# EasyEDA Pro project ProProject_训练营23_2023-12-06.epro, board PCB_PCB_不带频谱时钟_2_2023-11-23
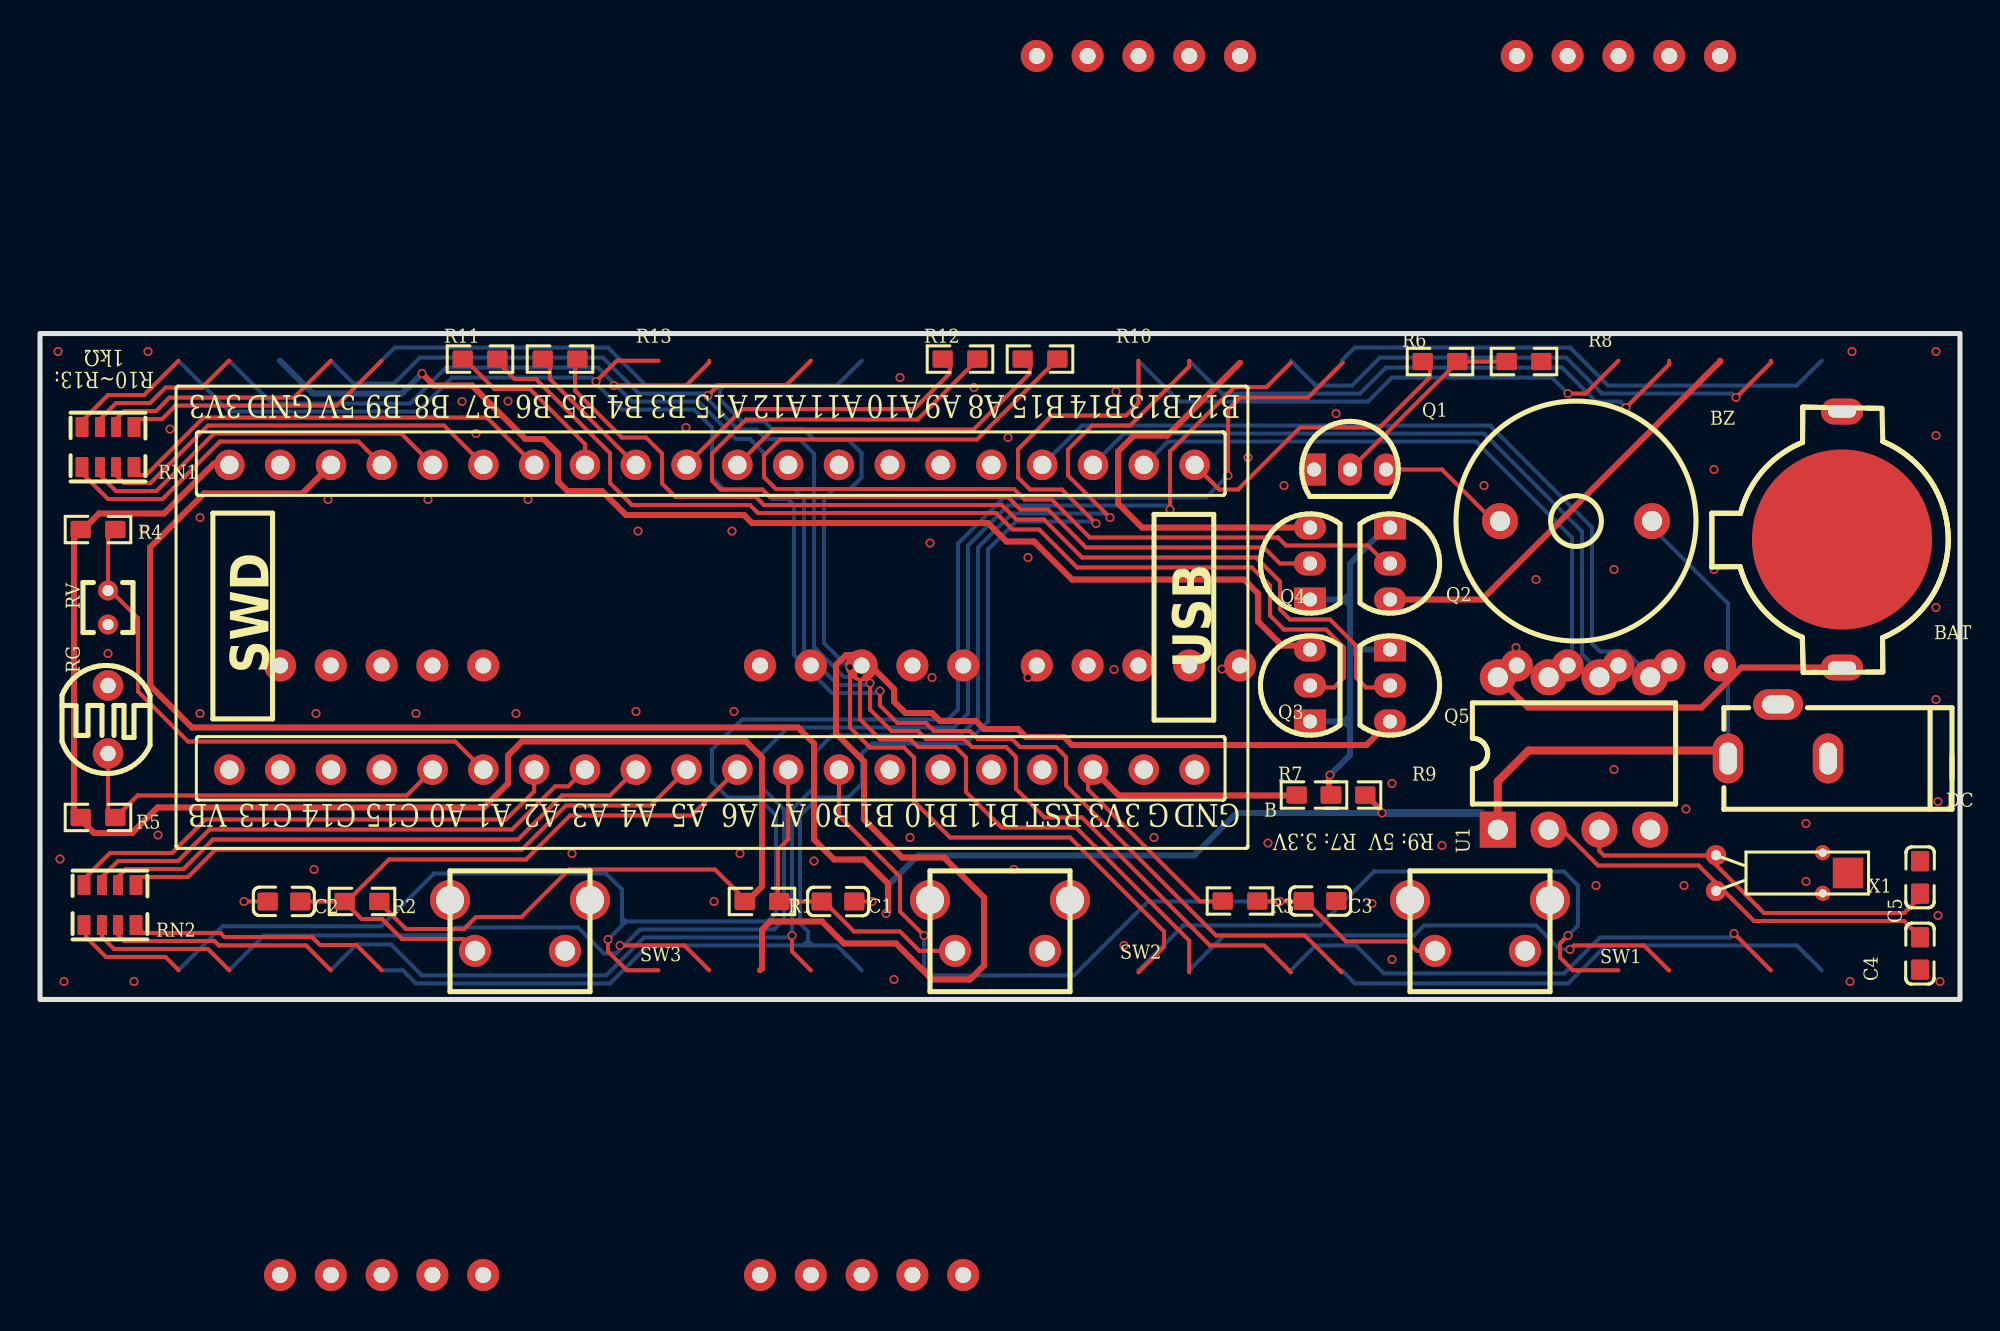
[diagram p5: board, top side]
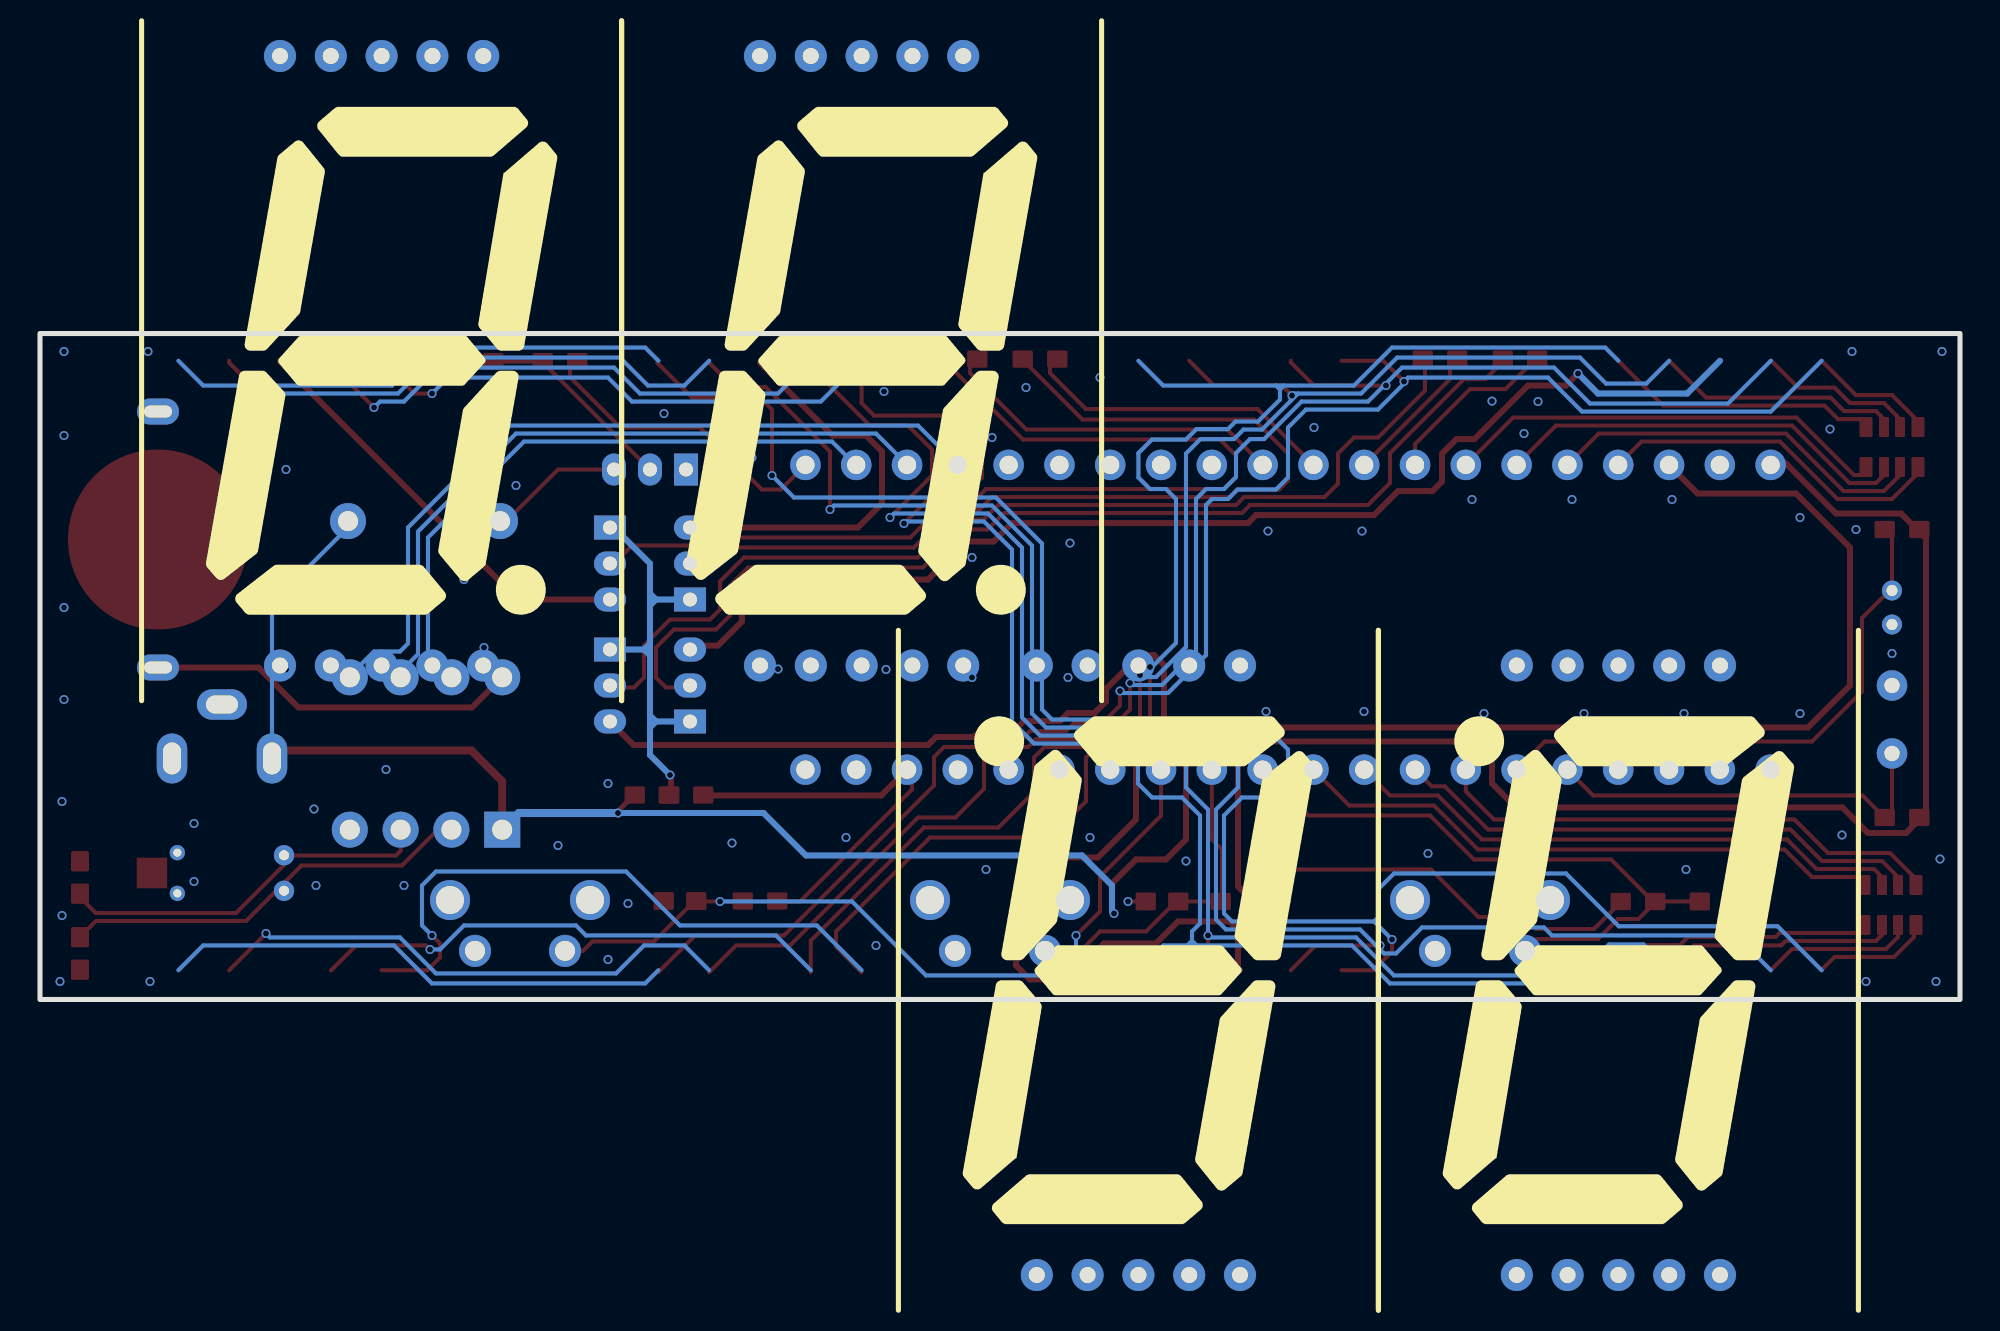
[diagram p6: board, bottom side, seen from below]

Outline 96 x 33.3 mm; copper layers: Top Layer, Bottom Layer. Coordinates in mm from the lower left corner of the outline.
Outline path: rectangle 0,33.3 96,0
Stack: Top Layer 0.035mm / Dielectric1 1.51mm FR4 er 4.5 / Bottom Layer 0.035mm

## Design rules (mm)
template: 用户自定义配置
spacing Default (default): track to track 0.152, other pairs 0 to 0.152
track width Default (default): min 0.152, default 0.203, max 25.4
differential pair differentialPair (default): width min 0.127, default 0.254, max 2.54; gap min 0.152, default 0.152
via Default (default): diameter min 0.45, default 0.45, max 100.025; hole min 0.3, default 0.3, max 59.995

## Placement (name value [footprint] x y rotation side)
B  -  [STM32F103C8T6核心板]  33.46 19.11 90 top
BAT  MY-1220-01  [BAT-TH_MY-1220-01]  90.1 23 270 top
BZ  2.3kHz  [BUZ-TH_BD12.0-P7.60-D0.6-FD]  76.8 23.92 180 top
C1  100nF  [C0603]  39.9 4.9 180 top
C2  100nF  [C0603]  12.2 4.9 0 top
C3  100nF  [C0603]  64 4.92 180 top
C4  22pF  [C0603]  94 2.3 90 top
C5  22pF  [C0603]  94 6.1 270 top
DC  DC-002-2.0A-1.65  [dc-in_dc-002-2.0a-1.65]  86.9 13.4 180 top
LED1  -  [1寸数码管]  84 16.7 180 bottom
LED2  -  [1寸数码管]  60 16.7 180 bottom
LED3  -  [1寸数码管]  36 16.7 0 bottom
LED4  -  [1寸数码管]  12 16.7 0 bottom
Q1  S8050  [s8050_to_92]  65.5 26.5 0 top
Q2  S9012  [S8550P_TO-92]  67.5 21.8 270 top
Q3  S9012  [s8550p_to-92]  63.5 15.7 90 top
Q4  S9012  [s8550p_to-92]  63.5 21.8 90 top
Q5  S9012  [s8550p_to-92]  67.5 15.7 270 top
R1  10K  [R0603]  36.1 4.9 180 top
R2  10K  [R0603]  16.1 4.9 0 top
R3  10K  [R0603]  60 4.92 180 top
R4  10k  [R0603]  2.9 23.5 180 top
R5  10k  [R0603]  2.9 9.1 180 top
R6  1k  [R0603]  70 31.9 0 top
R7  10K  [R0603]  63.7 10.22 180 top
R8  10K  [R0603]  74.2 31.9 180 top
R9  10K  [R0603]  65.4 10.22 0 top
R10  1K  [R0603]  50 32.02 180 top
R11  1K  [R0603]  22 32.02 180 top
R12  1K  [R0603]  46 32.02 180 top
R13  1K  [R0603]  26 32.02 180 top
RG  光敏电阻  [RES-TH_L5.1-W4.3-P3.40-D0.5]  3.4 14 180 top
RN1  470Ω  [RES-ARRAY-SMD_0603-8P-L3.2-W1.6-BL]  3.4 27.62 0 top
RN2  470Ω  [RES-ARRAY-SMD_0603-8P-L3.2-W1.6-BL]  3.5 4.72 0 top
RV  MF52A103F3950 (A1)  [RES-TH_L2.5-W2.5-P1.70-D0.3]  3.4 19.6 90 top
SW1  SKHHLQA010  [KEY-TH_4P-SKHHLQA010]  72 3.7 0 top
SW2  SKHHLQA010  [KEY-TH_4P-SKHHLQA010]  48 3.7 0 top
SW3  SKHHLQA010  [KEY-TH_4P-SKHHLQA010]  24 3.7 0 top
U1  DS1302N  [dip-8_l9.7-w6.4-p2.54-ls7.6-bl]  76.7 12.3 0 top
X1  32.768kHz  [CRYSTAL-TH_BD2.1-P0.70-D0.3]  83.8 6.32 180 top

## Footprints (pads in the part's own frame, mm; a bottom-side part is the same pattern mirrored in y, then rotated)
1寸数码管
  round 1.6 hole 0.8: 1(0,0) 2(2.54,0) 3(5.08,0) 4(7.62,0) 5(10.16,0) 6(10.16,30.48) 7(7.62,30.48) 8(5.08,30.48) 9(2.54,30.48) 10(0,30.48)
BAT-TH_MY-1220-01
  oval 1.3x2.1 hole 0.6x1.4: 1(-6.4,0) 1(6.4,0)
  round 9 smd: 2(0,0)
BUZ-TH_BD12.0-P7.60-D0.6-FD
  round 1.8 hole 1: 1(-3.8,0) 2(3.8,0)
C0603
  rrect 1.016x0.9 smd: 1(-0.813,0) 2(0.813,0)
CRYSTAL-TH_BD2.1-P0.70-D0.3
  oval 1.016x1.016 hole 0.5: 1(0,0.889) 2(0,-0.889)
  rect 1.524x1.524 smd: 3(-6.604,0)
  round 0.762 hole 0.406: 3(-5.334,1.016) 3(-5.334,-1.016)
dc-in_dc-002-2.0a-1.65
  oval 1.524x2.5 hole 0.9x1.6: 1(2.5,1.35) 2(-2.5,1.35)
  oval 2.5x1.524 hole 1.6x0.9: 3(0,-1.35)
dip-8_l9.7-w6.4-p2.54-ls7.6-bl
  rect 1.8x1.8 hole 1: 1(-3.81,-3.81)
  round 1.8 hole 1: 2(-1.27,-3.81) 3(1.27,-3.81) 4(3.81,-3.81) 5(3.81,3.81) 6(1.27,3.81) 7(-1.27,3.81) 8(-3.81,3.81)
KEY-TH_4P-SKHHLQA010
  round 1.6 hole 1: 1(-2.25,-1.27) 2(2.25,-1.27)
  round 2 hole 1.4: 3(3.5,1.27) 4(-3.5,1.27)
R0603
  rrect 1.016x0.864 smd: 1(-0.864,0) 2(0.864,0)
RES-ARRAY-SMD_0603-8P-L3.2-W1.6-BL
  rrect 0.65x1 smd: 1(-1.3,-1) 4(1.3,-1) 5(1.3,1) 8(-1.3,1)
  rrect 0.5x1 smd: 2(-0.4,-1) 3(0.4,-1) 6(0.4,1) 7(-0.4,1)
RES-TH_L2.5-W2.5-P1.70-D0.3
  round 1 hole 0.55: 1(-0.85,0) 2(0.85,0)
RES-TH_L5.1-W4.3-P3.40-D0.5
  round 1.524 hole 0.762x0.767: 1(0,-1.7) 2(0,1.7)
s8050_to_92
  rect 1.2x1.6 hole 0.701: 1(-1.8,0)
  oval 1.2x1.6 hole 0.701: 2(0,0) 3(1.8,0)
s8550p_to-92
  rect 1.2x1.6 hole 0.7: 1(-1.8,0)
  oval 1.2x1.6 hole 0.7: 2(0,0) 3(1.8,0)
S8550P_TO-92
  rect 1.2x1.6 hole 0.7: 1(-1.8,0)
  oval 1.2x1.6 hole 0.7: 2(0,0) 3(1.8,0)
STM32F103C8T6核心板
  round 1.524 hole 0.914: 1(-7.62,23.993) 2(-7.62,21.453) 3(-7.62,18.913) 4(-7.62,16.373) 5(-7.62,13.833) 6(-7.62,11.293) 7(-7.62,8.753) 8(-7.62,6.213) 9(-7.62,3.673) 10(-7.62,1.133) 11(-7.62,-1.407) 12(-7.62,-3.947) 13(-7.62,-6.487) 14(-7.62,-9.027) 15(-7.62,-11.567) 16(-7.62,-14.107) 17(-7.62,-16.647) 18(-7.62,-19.187) 19(-7.62,-21.727) 20(-7.62,-24.267) 21(7.62,-24.267) 22(7.62,-21.727) 23(7.62,-19.187) 24(7.62,-16.647) 25(7.62,-14.107) 26(7.62,-11.567) 27(7.62,-9.027) 28(7.62,-6.487) 29(7.62,-3.947) 30(7.62,-1.407) 31(7.62,1.133) 32(7.62,3.673) 33(7.62,6.213) 34(7.62,8.753) 35(7.62,11.293) 36(7.62,13.833) 37(7.62,16.373) 38(7.62,18.913) 39(7.62,21.453) 40(7.62,23.993)

## Nets
As in the schematic, except:
3V3: B.18 B.40 R1.2 R2.2 R3.2 R4.2 R5.2 R7.2
GND: B.19 B.20 B.39 BAT.2 C1.1 C2.1 C3.1 C4.1 C5.1 DC.2 DC.3 Q1.1 R8.1 RG.1 RV.1 SW1.2 SW1.3 SW1.4 SW2.2 SW2.3 SW2.4 SW3.2 SW3.3 SW3.4 U1.4 X1.3
VCC: B.38 BZ.1 DC.1 R9.2 U1.1
LEDCOM1: LED1.8 Q2.3
LEDCOM2: LED2.8 Q4.3
LEDCOM3: LED3.8 Q5.3
LEDCOM4: LED4.3 Q3.3

Pads without a net: B 1 2 3 4 14 15 16 17 25 26 27 28 29; LED1 3; LED2 3; LED3 3; LED4 8

## Via types
v1: diameter 0.45, hole 0.3, Top Layer to Bottom Layer, 103 vias

## Routing (per net, layer and track width the routed paths; a pad name or vN(x,y) marks a point on that pad's centre or on a via; arc(x,y) is an arc through that point)
3V3: length 110.7
  Top Layer w0.203: 59.35,4.9 58,4.9 52.4,10.5 52.4,11.24 B.18 ; 35.35,4.9 33.75,6.5 26.45,6.5 24.08,4.12 21.8,4.12 21.2,3.52 18.3,3.52 16.92,4.9 16.85,4.9
  Top Layer w0.3: 2.1,9.1 2.1,8.92 2.7,8.32 4.6,8.32 5.88,9.6 22.2,9.6 23.4,10.8 23.4,12.2 24.1,12.9 35.3,12.9 36.1,12.1 36.1,5.65 35.35,4.9 ; 2.1,9.1 2.15,9.1 ; 2.1,9.1 1.7,9.5 1.7,23.05 2.95,24.3 6.2,24.3 8.7,26.8 9.4,26.8 B.40 ; 62.95,10.2 53.94,10.2 B.18
3V32: length 22.4
  Top Layer w0.3: v1(64.5,11.22) 64.45,11.17 64.45,10.79 64.45,10.78 64.45,10.2
  Bottom Layer w0.3: Q2.1 67.3,23.6 65.5,21.8 65.5,20.3 ; 65.8,17.5 65.5,17.2 ; 65.8,17.5 65.5,17.8 ; 65.8,17.5 Q5.1 ; 65.5,17.2 65.5,14.2 ; 65.5,17.2 65.5,17.8 ; 65.5,13.6 65.5,14.2 ; 65.5,13.6 65.2,13.9 ; 65.5,13.6 65.5,12.22 v1(64.5,11.22) ; 65.5,14.2 65.2,13.9 ; 65.2,20 65.5,20.3 ; 65.2,20 Q4.1 ; 65.2,20 65.5,19.7 ; 65.5,20.3 65.5,19.7 ; 65.5,17.8 65.5,19.7 ; 65.2,13.9 Q3.1
GND: length 2.3
  Top Layer w0.203: 40.6,4.9 v1(41.6,4.9) ; 11.5,4.9 v1(10.2,4.9)
  vias: v1(0.9,32.4) v1(1,7.02) v1(1.2,0.9) v1(3.4,17.3) v1(4.7,0.9) v1(5.2,23.5) v1(5.4,32.4) v1(5.9,8.22) v1(6.5,28.52) v1(8,24.1) v1(8,14.3) v1(13.7,6.5) v1(13.8,14.3) v1(14.4,25) v1(18.8,14.3) v1(19.4,25) v1(21.1,29.9) v1(21.8,28.3) v1(23.4,29.92) v1(23.8,14.3) v1(24.4,25) v1(26.6,7.3) v1(29.8,14.4) v1(29.9,23.42) v1(32.3,28.6) v1(33.7,4.9) v1(34.6,23.42) v1(34.7,14.4) v1(35,7.3) v1(38.7,6.92) v1(42.7,1) v1(43,31.1) v1(43.5,8.1) v1(44.5,22.82) v1(44.6,16.1) v1(46.7,30.6) v1(48.4,28.1) v1(48.7,6.5) v1(49.4,22.1) v1(49.4,16.1) v1(53.7,16.5) v1(53.8,30.4) v1(54.2,2.7) v1(55.7,8.1) v1(59.1,16.52) v1(60.4,27.1) v1(61.4,7.82) v1(62.2,25.7) v1(64.8,29.3) v1(66.6,4.8) v1(67.6,10.8) v1(67.6,2) v1(70.1,7.7) v1(72.2,25.7) v1(73.8,17.6) v1(74.8,21) v1(77.8,5.7) v1(78.7,21.5) v1(78.7,11.5) v1(82.2,5.7) v1(82.3,9.52) v1(83.7,26.5) v1(83.7,21.5) v1(83.7,16.5) v1(88.3,8.8) v1(88.3,5.9) v1(90.5,0.9) v1(90.6,32.4) v1(94.8,32.4) v1(94.8,28.2) v1(94.8,19.6) v1(94.8,15) v1(94.9,9.9) v1(94.9,4.2) v1(95,0.9)
VCC: length 125.9
  Top Layer w0.25: R9.2 66.3,10.22 67.1,9.42 v1(67.1,9.32)
  Top Layer w0.3: B.38 13.12,25.3 8.2,25.3 5.5,22.6 5.5,15.7 7.6,13.6 37.9,13.6 38.7,12.8 38.7,8 39.7,7 41.2,7 42.4,5.8 42.4,4.4 v1(42.3,4.3)
  Top Layer w0.4: U1.1 72.89,10.91 74.43,12.45 84,12.45 DC.1
  Bottom Layer w0.203: 80.6,23.6 84.4,19.8 DC.1
  Bottom Layer w0.3: v1(42.3,4.3) 42.4,4.4 42.4,5.7 43.9,7.2 57.7,7.2 59.82,9.32 v1(67.1,9.32)
  Bottom Layer w0.4: U1.1 72.06,9.32 v1(67.1,9.32)
A: length 113
  Top Layer w0.203: 3.9,3.82 3.9,3.22 4.2,2.92 8.72,2.92 8.94,2.7 13.3,2.7 14.54,1.46 ; v1(37.6,3.2) 37.6,2.4 38.54,1.46 ; 81.46,31.94 81.46,31.76 v1(79.3,29.6) ; 57.46,31.94 57.46,31.65 54.51,28.7 52.6,28.7 51.4,27.5 51.4,26.2 v1(53.5,24.1)
  Bottom Layer w0.203: 14.54,1.46 15.83,2.75 17.55,2.75 19.1,1.2 28.3,1.2 30.2,3.1 37.5,3.1 v1(37.6,3.2) 37.6,9.5 38.7,10.6 38.7,12.3 39.6,13.2 46,13.2 46.9,14.1 46.9,22.6 48.6,24.3 53.3,24.3 v1(53.5,24.1) ; v1(79.3,29.6) 79,29.9 77.8,29.9 76.1,31.6 67.3,31.6 66,30.3 59.1,30.3 57.46,31.94
B: length 114.6
  Top Layer w0.203: 78.92,31.94 77.28,30.3 v1(76.4,30.3) ; 4.7,3.82 RN2.4 4.8,3.68 5.16,3.33 9.02,3.33 9.22,3.12 13.6,3.12 14,2.72 15.82,2.72 17.08,1.46 ; v1(52.8,23.8) 51.1,25.5 49.5,25.5 48.9,26.1 48.9,27.51 50.59,29.2 54.3,29.2 54.92,29.82 54.92,31.94
  Bottom Layer w0.203: 54.92,31.94 56.96,29.9 66.4,29.9 67.6,31.1 75.6,31.1 v1(76.4,30.3) ; 38.17,2.7 30.4,2.7 28.5,0.8 18.8,0.8 18.14,1.46 17.08,1.46 ; 38.17,2.7 38.63,2.7 ; 38.17,2.7 38.4,2.93 ; 38.4,2.93 38.63,2.7 ; 38.4,2.93 38.4,3.4 38,3.8 38,9.2 38.9,10.1 40.4,10.1 41.1,10.8 41.1,12.3 41.6,12.8 46.3,12.8 47.4,13.9 47.4,22.5 48.8,23.9 52.7,23.9 v1(52.8,23.8) ; 38.63,2.7 39.84,2.7 41.08,1.46
BEEP: length 15.5
  Top Layer w0.203: 69.25,31.9 69.5,31.65 69.5,31.12 66.98,28.6 63,28.6 59.9,25.5 58.96,25.5 B.21
C: length 110.6
  Top Layer w0.203: 3.8,28.52 3.8,29.02 4.2,29.42 5.8,29.42 6.48,30.1 12.7,30.1 14.54,31.94 ; v1(33.4,30.2) 33.92,30.72 37.32,30.72 38.54,31.94 ; v1(76.5,2.5) 76.7,2.7 80.2,2.7 81.44,1.46 81.46,1.46 ; 57.46,1.36 57.46,2.94 51.8,8.6 48.07,8.6 46.3,10.37 46.3,12.1 45.78,12.62 43.9,12.62 43.52,13 42.01,13 41,14.01 v1(41,16.22)
  Bottom Layer w0.203: v1(41,16.22) 40.9,16.12 40.2,16.12 38.7,17.62 38.7,27.3 38.41,27.59 37.98,28.02 36.3,28.02 35.82,28.5 34.9,28.5 33.46,29.94 ; 33.46,29.94 33.46,30.14 v1(33.4,30.2) 33.3,30.3 33.1,30.3 ; 33.46,29.94 33.1,30.3 ; 14.54,31.94 15.68,30.8 17.7,30.8 19,32.1 28.14,32.1 29.94,30.3 33.1,30.3 ; 57.46,1.46 59.2,3.2 68.7,3.2 69.2,3.7 74.8,3.7 76,2.5 v1(76.5,2.5)
COM1: length 17.3
  Top Layer w0.203: 49.35,32 49.5,31.85 49.5,31.32 46.68,28.5 36.64,28.5 B.30
COM2: length 15.9
  Top Layer w0.203: 45.2,32 45.5,31.7 45.5,31.32 43.7,29.52 35.12,29.52 B.31
COM3: length 7.1
  Top Layer w0.203: 25.25,32 25.5,31.75 25.5,31.02 B.32
COM4: length 8.8
  Top Layer w0.203: B.33 27.25,27.77 24.5,30.52 22.72,30.52 21.25,32
D: length 114.4
  Top Layer w0.203: 3,28.52 3,29.02 3.8,29.82 5.5,29.82 6.28,30.6 8.1,30.6 9.44,31.94 9.46,31.94 ; 62.54,1.36 61.2,2.7 58.5,2.7 52.1,9.1 50.23,9.1 48.8,10.53 48.8,12.12 48.3,12.62 46.6,12.62 46.2,13.02 44.3,13.02 43.9,13.42 42.58,13.42 41.5,14.5 v1(41.5,15.82) ; v1(28.7,30.7) 32.3,30.7 33.46,31.86 33.46,31.94 ; v1(84.7,3.3) 86.54,1.46
  Bottom Layer w0.203: v1(41.5,15.82) 41.4,15.72 39.9,15.72 38.2,17.42 38.2,25.02 37.7,25.52 36.8,25.52 36.2,26.12 36.2,27.32 35.5,28.02 34.8,28.02 32.92,29.9 29.6,29.9 28.8,30.7 v1(28.7,30.7) 28.7,30.8 27.9,31.6 20.3,31.6 18.5,29.8 11.6,29.8 9.46,31.94 ; v1(84.7,3.3) 84.5,3.1 78,3.1 76.2,1.3 67.2,1.3 65.8,2.7 63.78,2.7 62.54,1.46
DP: length 119.6
  Top Layer w0.203: 17.08,31.94 14.84,29.7 6.78,29.7 6.1,29.02 5,29.02 4.6,28.62 4.6,28.52 ; v1(40.5,16.62) 40.5,13.6 41.5,12.6 43.2,12.6 43.7,12.1 43.7,9.9 45.51,8.1 51.5,8.1 56.2,3.4 56.2,2.64 54.92,1.36 ; 78.92,1.46 76.64,1.46 76,2.1 76,2.8 v1(76.4,3.2)
  Bottom Layer w0.203: 54.92,1.46 57.16,3.7 64,3.7 66.7,6.4 76.2,6.4 76.9,5.7 76.9,3.7 v1(76.4,3.2) ; v1(40.5,16.62) 40.4,16.62 39.2,17.82 39.2,25.02 39.7,25.52 40.5,25.52 41.08,26.1 41.08,27.32 40.4,28 38.7,28 38.18,28.52 36.6,28.52 36.22,28.9 35.1,28.9 34,30 34,30.5 ; 34,30.5 33.8,30.7 ; 34,30.5 34.2,30.7 ; 41.08,31.94 39.84,30.7 34.2,30.7 ; 17.08,31.94 17.74,32.6 28.4,32.6 30.3,30.7 33.8,30.7 ; 34.2,30.7 33.8,30.7
DS_DAT: length 34.8
  Bottom Layer w0.203: 52.63,26.73 54.2,28.3 72.2,28.3 77.1,23.4 77.1,17.27 77.97,16.4 U1.6
DS_RST: length 39.9
  Bottom Layer w0.203: 50.13,26.73 52.1,28.7 72.5,28.7 77.6,23.6 77.6,17.8 78,17.4 79.3,17.4 80.51,16.19 U1.5
DS_SCK: length 31.3
  Bottom Layer w0.203: U1.7 76.6,17.28 76.6,23.1 71.8,27.9 56.4,27.9 55.23,26.73
E: length 115
  Top Layer w0.203: 65.08,1.36 63.24,3.2 58.8,3.2 51.3,10.7 51.3,12.12 50.8,12.62 49,12.62 48.6,13.02 46.9,13.02 46.5,13.42 44.7,13.42 44.3,13.82 42.88,13.82 42,14.7 v1(42,15.42) ; 6.92,31.94 5.2,30.22 3.4,30.22 2.2,29.02 2.2,28.52 ; 30.92,31.94 28.84,31.94 v1(27.8,30.9)
  Bottom Layer w0.203: 6.92,31.94 9.46,29.4 18.9,29.4 20.6,31.1 27.6,31.1 v1(27.8,30.9) 27.8,30.8 29.1,29.5 32.7,29.5 33.6,28.6 33.6,26.1 34.2,25.5 36.12,25.5 36.6,25.02 37.4,25.02 37.7,24.72 37.7,17.22 39.6,15.32 41.9,15.32 v1(42,15.42) ; 89.08,1.46 87.84,2.7 78.3,2.7 76.4,0.8 65.74,0.8 65.08,1.46
F: length 119.5
  Top Layer w0.203: 62.54,31.84 61.32,30.62 59.72,30.62 56.5,27.4 v1(56.5,24.5) ; v1(29,2.7) 32.22,2.7 33.46,1.46 ; 86.54,31.94 86.54,31.84 v1(84.8,30.1) ; 9.46,1.46 8.4,2.52 3.7,2.52 3.1,3.12 3.1,3.82
  Bottom Layer w0.203: 62.54,31.94 63.78,30.7 65.6,30.7 67,32.1 76.3,32.1 78.1,30.3 84.6,30.3 v1(84.8,30.1) ; v1(56.5,24.5) 56.3,24.7 48.4,24.7 46.4,22.7 46.4,14.3 45.7,13.6 37.4,13.6 36.1,12.3 36.1,10.6 37.2,9.5 37.2,4 36.7,3.5 30,3.5 29.2,2.7 v1(29,2.7) 29,2.5 28.8,2.3 28.2,2.3 26.9,3.6 20.8,3.6 20.4,3.2 11.2,3.2 9.46,1.46
G: length 127.4
  Top Layer w0.203: 2.3,3.82 2.3,3.12 3.3,2.12 6.28,2.12 6.92,1.48 6.92,1.46 ; 30.92,1.46 29.34,1.46 28.4,2.4 v1(28.4,3) ; 65.14,31.84 63.4,30.1 60,30.1 59.4,29.5 v1(59.4,26.2)
  Bottom Layer w0.203: 6.92,1.46 9.12,3.66 17.06,3.66 19.7,6.3 28.3,6.3 29.1,5.5 29.1,4.1 ; 89.08,31.94 87.84,30.7 78.4,30.7 76.5,32.6 65.74,32.6 65.08,31.94 ; 29.1,4.1 29.1,3.7 ; 29.1,4.1 29.3,3.9 ; 29.1,3.7 29.3,3.9 ; 29.1,3.7 v1(28.4,3) ; 29.3,3.9 36.4,3.9 36.8,4.3 36.8,9.2 35.9,10.1 34.4,10.1 33.6,10.9 33.6,12.5 35.1,14 45.4,14 45.9,14.5 45.9,22.8 48.2,25.1 58.3,25.1 v1(59.4,26.2)
GM: length 19.6
  Top Layer w0.203: 3.4,11.6 3.4,9.35 3.72,9.04 4.88,10.2 18.34,10.2 B.5
KEY1: length 41.1
  Top Layer w0.203: SW1.1 68.85,2.43 68.38,2.9 65.3,2.9 63.3,4.9 v1(62,4.9) 60.85,4.9 ; v1(44.2,3.2) 43,4.4 43,6.14 39.95,9.19 B.13
  Bottom Layer w0.203: v1(62,4.9) 55.4,4.9 51.7,1.2 44.6,1.2 44.2,1.6 v1(44.2,3.2)
KEY2: length 16.7
  Top Layer w0.203: B.12 37.41,8.01 36.9,7.5 36.9,4.95 36.85,4.9 39.2,4.9 40.7,3.4 43,3.4 43.97,2.43 SW2.1
KEY3: length 32.2
  Top Layer w0.203: 15.35,4.9 17.45,7 24.3,7 26.5,9.2 32.58,9.2 B.11 ; 15.35,4.9 15.35,4.75 16.08,4.02 17.1,4.02 18.1,3.02 21.16,3.02 SW3.1 ; 15.35,4.9 12.9,4.9
LEDCOM1: length 21.7
  Top Layer w0.3: 84,31.94 84,31.9 72.1,20 67.3,20
LEDCOM2: length 20.7
  Top Layer w0.3: 63.6,23.6 55.1,23.6 53.9,24.8 53.9,27.4 54.7,28.2 56.36,28.2 60,31.84
LEDCOM3: length 64.8
  Top Layer w0.3: 36,1.46 36.1,1.56 36.1,3.49 36.51,3.9 39.1,3.9 40.2,2.8 42.8,2.8 44.6,1 46.5,1 47.2,1.7 47.2,5.1 45.2,7.1 43.1,7.1 41.2,9 41.2,11.9 39.8,13.3 39.8,16.72 40.3,17.22 41,17.22 42.7,15.52 42.7,14.9 43.28,14.32 44.6,14.32 45,13.92 46.8,13.92 47.2,13.52 48.9,13.52 49.3,13.12 51.2,13.12 51.6,12.72 66.32,12.72 Q5.3
LEDCOM4: length 60
  Top Layer w0.3: 63.5,17.4 63.2,17.7 62.1,17.7 60.9,18.9 60.9,20.3 60.2,21 51.6,21 49.7,22.9 48.32,22.9 47.4,23.82 35.6,23.82 35.2,24.22 29.3,24.22 28.1,25.42 26.38,25.42 25.9,25.9 25.9,27.3 25.18,28.02 24.28,28.02 21.6,30.7 19.7,30.7 v1(19.1,31.3)
  Bottom Layer w0.3: v1(19.1,31.3) 18.1,30.3 13.64,30.3 12,31.94
RM: length 27.9
  Top Layer w0.203: B.6 20.76,12.9 7.4,12.9 4.9,15.4 4.9,19.07 3.4,20.57 3.4,23.45 3.65,23.7
$1N45: length 6.9
  Top Layer w0.203: 73,23.6 70.1,26.5 Q1.3
$1N120: length 18.7
  Top Layer w0.3: U1.8 74.4,14.6 83.08,14.6 85.08,16.6 90.1,16.6
$1N175: length 21
  Top Layer w0.203: U1.2 76.11,8.49 77.9,6.7 82.92,6.7 85.7,3.92 93.2,3.92 94.12,3
$1N176: length 19
  Top Layer w0.203: 94,5.4 94,5.11 93.21,4.32 86.2,4.32 83.32,7.2 78.2,7.2 77.97,7.43 U1.3
$1N3437: length 10
  Top Layer w0.203: 73.22,31.94 73.22,31.9 70.85,31.9 70.85,31.85 Q1.2
$1N3552: length 50.6
  Top Layer w0.203: 67.3,21.8 66.4,22.7 62.3,22.7 61.9,23.1 52.49,23.1 50.59,25 49.22,25 48.7,25.52 36.8,25.52 36.2,26.12 36.2,27.2 37,28 46.85,28 50.85,32
$1N3648: length 53.6
  Top Layer w0.203: 22.75,32 23.73,31.02 24.8,31.02 28.5,27.32 28.5,25.82 29.6,24.72 35.5,24.72 35.9,24.32 47.8,24.32 48.62,23.5 49.96,23.5 51.86,21.6 60.6,21.6 61.5,20.7 61.5,19.2 62.2,18.5 64.3,18.5 65.2,17.6 65.2,16.1 64.7,15.6 63.5,15.6
$1N3719: length 48.1
  Top Layer w0.203: Q4.2 62,21.8 61.2,22.6 52.3,22.6 50.4,24.5 49.02,24.5 48.4,25.12 36.5,25.12 36.12,25.5 34.04,25.5 33.6,25.94 33.6,27.3 35.3,29 43.88,29 46.75,31.88 46.75,32
$1N3790: length 51.1
  Top Layer w0.203: 26.75,32 26.75,30.45 29.1,28.1 30.3,28.1 31.1,27.3 31.1,25.8 31.78,25.12 35.8,25.12 36.2,24.72 48.1,24.72 48.82,24 50.2,24 52.1,22.1 60.8,22.1 62,20.9 62,19.5 62.5,19 64.5,19 65.8,17.7 65.8,16.1 66.3,15.6 67.5,15.6
$1N4595: length 17.6
  Top Layer w0.203: 2.2,26.72 2.2,26.22 3.4,25.02 6.12,25.02 9,27.9 15.92,27.9 B.37
$1N4627: length 19.3
  Top Layer w0.203: B.36 18.06,28.3 8.7,28.3 5.82,25.42 3.8,25.42 3,26.22 3,26.72
$1N4659: length 21
  Top Layer w0.203: 3.8,26.72 3.8,26.22 4.2,25.82 5.52,25.82 8.4,28.7 20.2,28.7 B.35
$1N4691: length 22.6
  Top Layer w0.203: 4.6,26.72 4.6,26.59 4.97,26.22 5.3,26.22 8.18,29.1 22.34,29.1 B.34
$1N4827: length 25.8
  Top Layer w0.203: 2.3,5.62 2.3,6.12 3.5,7.32 6.6,7.32 8.28,9 23.3,9 24.71,10.41 B.7
$1N4832: length 26.9
  Top Layer w0.203: 3.1,5.62 3.1,6.12 3.9,6.92 6.9,6.92 8.48,8.5 23.6,8.5 25.76,10.66 26.42,10.66 B.8
$1N4837: length 28.6
  Top Layer w0.203: B.9 28.5,10.2 26.1,10.2 23.9,8 8.65,8 7.17,6.52 4.3,6.52 3.9,6.12 3.9,5.62
$1N4842: length 30.1
  Top Layer w0.203: 4.7,5.62 4.7,5.72 5.1,6.12 7.4,6.12 8.78,7.5 24.1,7.5 26.3,9.7 30.54,9.7 B.10

## Copper pours and planes (outline as drawn; the poured copper is in the pictures)
GND on Top Layer: -2.8,35.4 100.8,35.4 100.8,-4.4 -2.8,-4.4
GND on Bottom Layer: -1.3,35.2 98,35.2 98,-3.5 -1.3,-3.5

## Text on the board
Top Solder Mask Layer: 大学生实践与创新 | 能力提升训练营
Top Silkscreen Layer: SWD | USB | 1kΩ | R10~R13: | R9: 5V  R7: 3.3V | 3V3 | GND | 5V | C14 | B9 | C15 | B8 | A0 | B7 | A1 | B6 | A2 | B5 | A3 | B4 | A4 | B3 | A5 | A15 | A6 | A12 | A7 | B0 | A11 | B1 | A10 | B10 | A9 | A8 | B11 | B15 | RST | B14 | G | B13 | B12 | VB | C13
